# EAGLE design car1 (EAGLE 7.7.0)
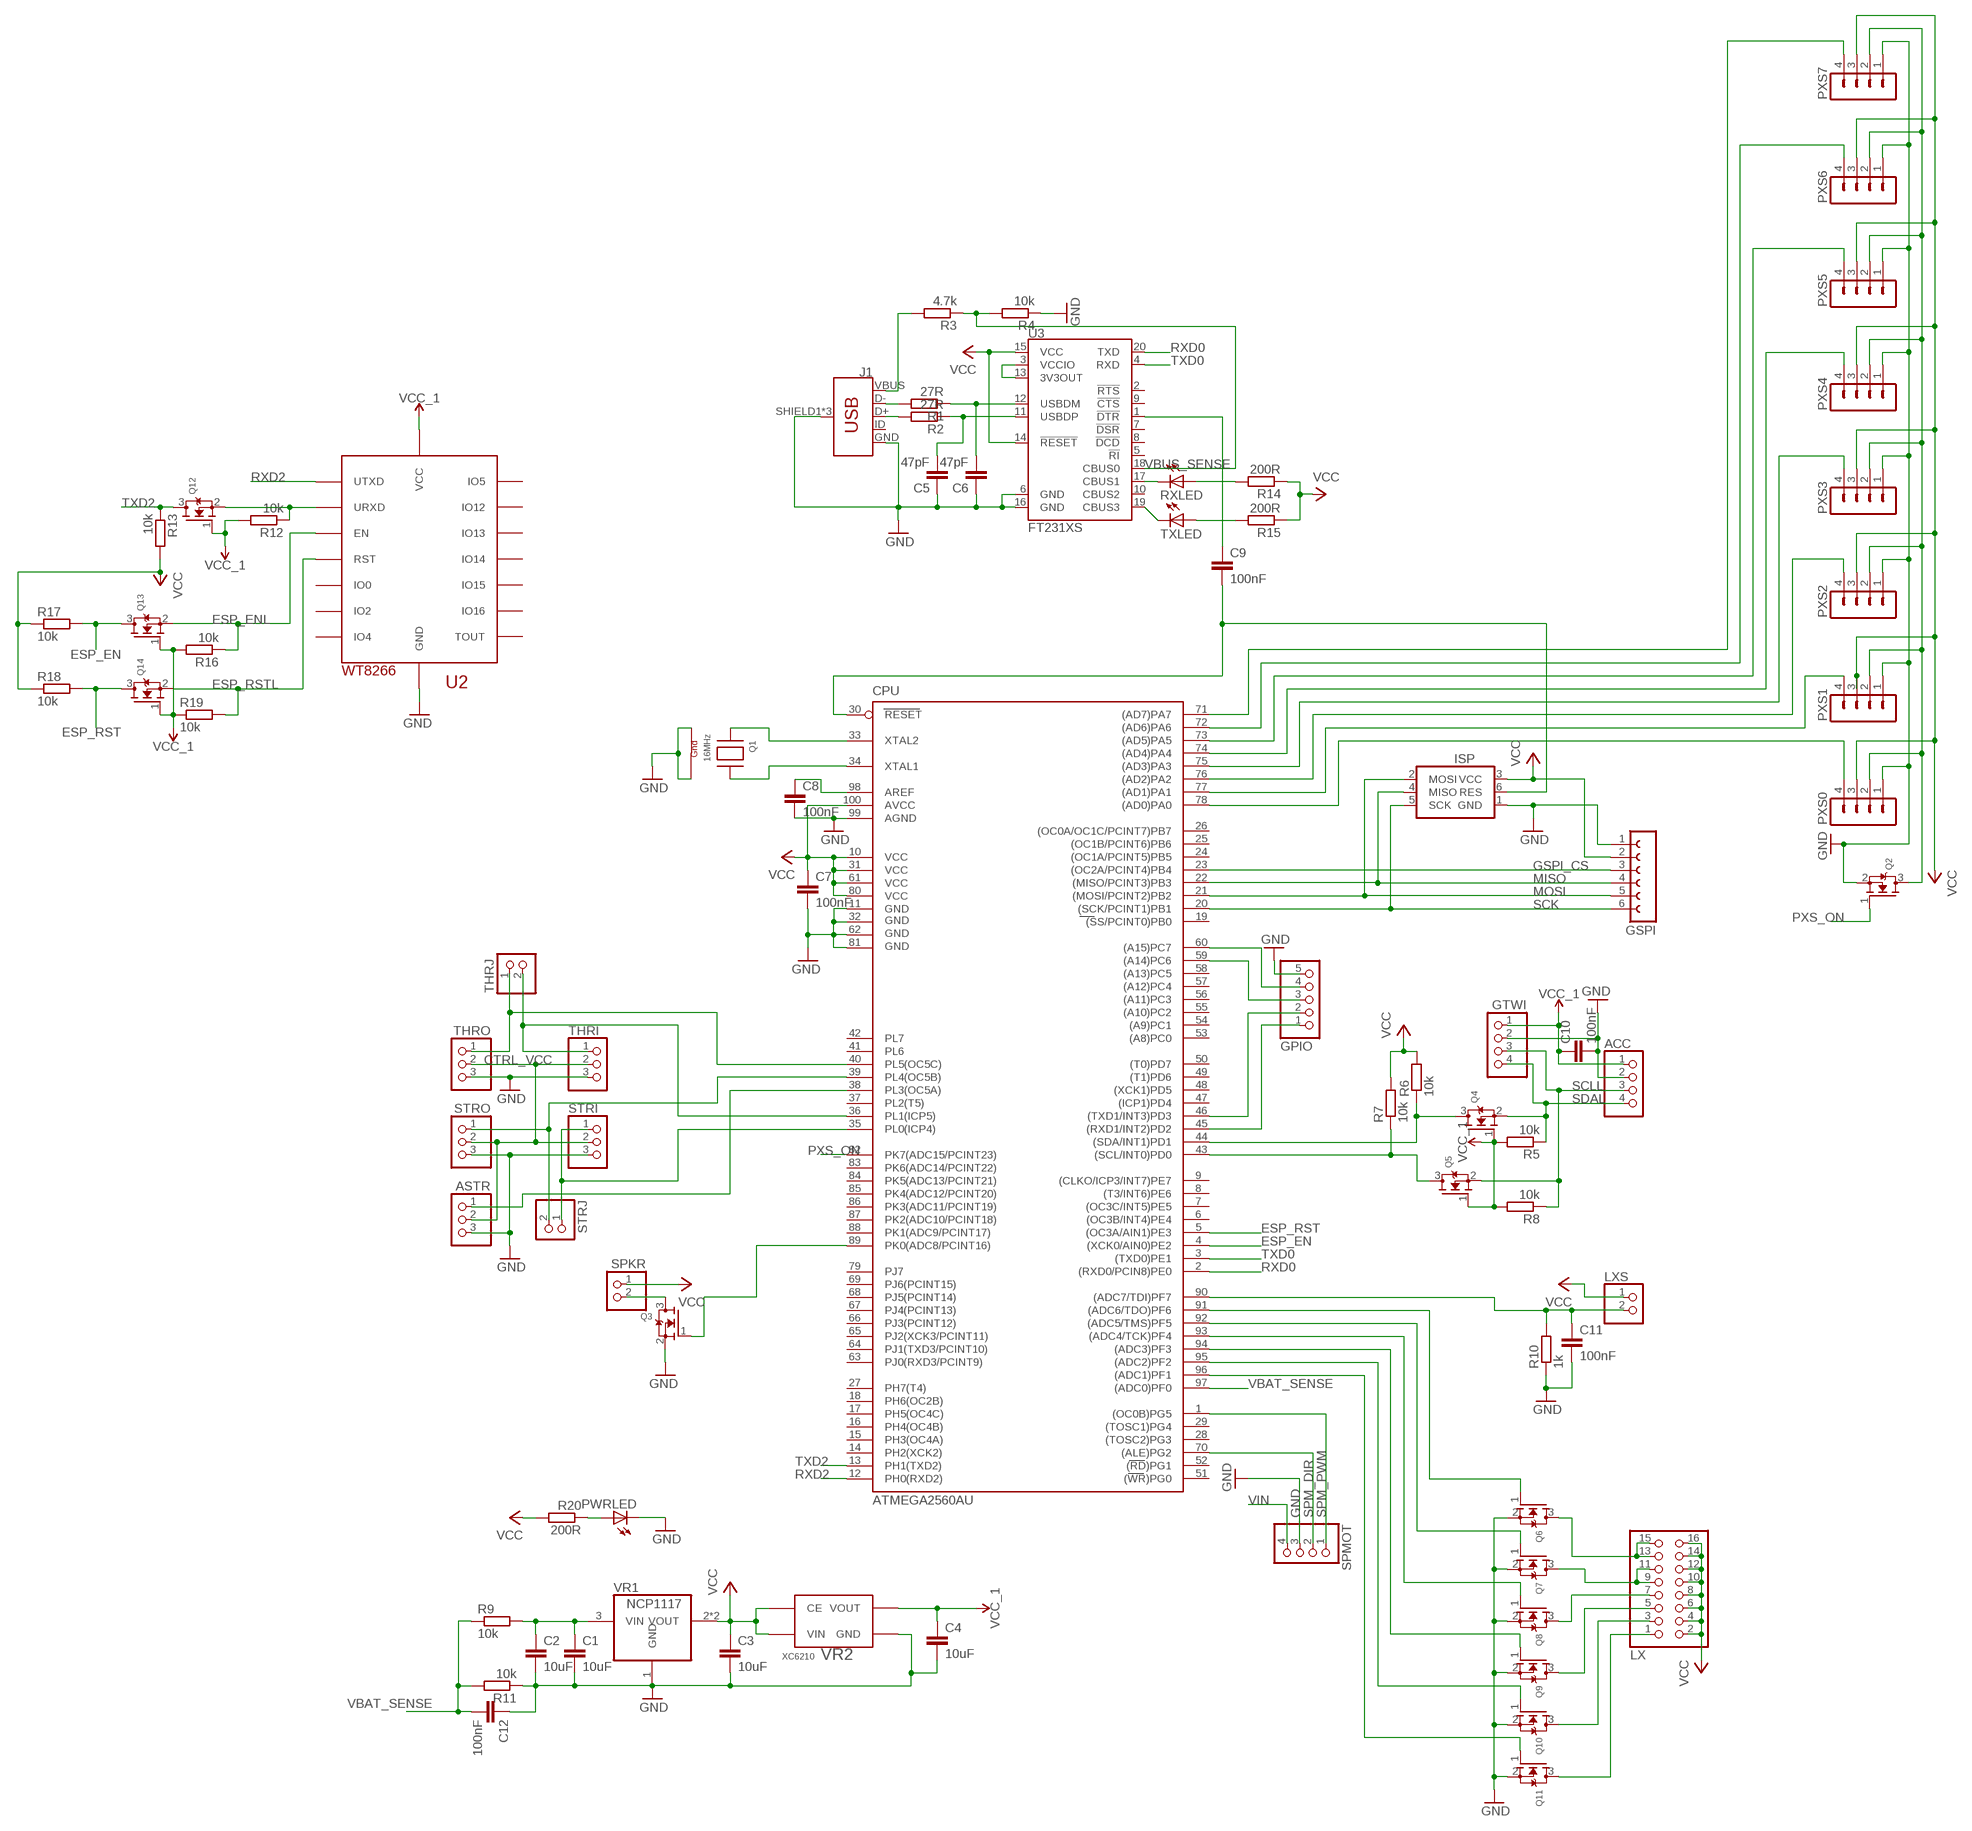
[diagram p0: schematic, sheet 1]

## Parts
ACC  PINHD-1X4  [1X04]
ASTR  PINHD-1X3  [1X03]
C1  10uF  C-EUC1206  [C1206]
C2  10uF  C-EUC1206  [C1206]
C3  10uF  C-EUC1206  [C1206]
C4  10uF  C-EUC1206  [C1206]
C5  47pF  C-EUC0603  [C0603]
C6  47pF  C-EUC0603  [C0603]
C7  100nF  C-EUC1206  [C1206]
C8  100nF  C-EUC1206  [C1206]
C9  100nF  C-EUC1206  [C1206]
C10  100nF  C-EUC1206  [C1206]
C11  100nF  C-EUC1206  [C1206]
C12  100nF  C-EUC1206  [C1206]
CPU  ATMEGA2560AU  [TQFP100]
GPIO  PINHD-1X5  [1X05]
GSPI  FE06W  [FE06W]
GTWI  PINHD-1X4/90  [1X04/90]
ISP  ISP  [ISP]
J1  USB_MICRO-B_FEMALE-SMT  [USB-B-MICRO-SMD]
LX  PINHD-2X8  [2X08]
LXS  PINHD-1X2  [1X02]
PWRLED  LEDCHIP-LED0603  [CHIP-LED0603]
PXS0  MA04-1  [MA04-1]
PXS1  MA04-1  [MA04-1]
PXS2  MA04-1  [MA04-1]
PXS3  MA04-1  [MA04-1]
PXS4  MA04-1  [MA04-1]
PXS5  MA04-1  [MA04-1]
PXS6  MA04-1  [MA04-1]
PXS7  MA04-1  [MA04-1]
Q1  16MHz  XTAL-4-3225  [NX3225]
Q2  MOSFET-NREFLOW  [SOT23]
Q3  MOSFET-NREFLOW  [SOT23]
Q4  MOSFET-NREFLOW  [SOT23]
Q5  MOSFET-NREFLOW  [SOT23]
Q6  MOSFET-NREFLOW  [SOT23]
Q7  MOSFET-NREFLOW  [SOT23]
Q8  MOSFET-NREFLOW  [SOT23]
Q9  MOSFET-NREFLOW  [SOT23]
Q10  MOSFET-NREFLOW  [SOT23]
Q11  MOSFET-NREFLOW  [SOT23]
Q12  MOSFET-NREFLOW  [SOT23]
Q13  MOSFET-NREFLOW  [SOT23]
Q14  MOSFET-NREFLOW  [SOT23]
R1  27R  R-EU_R0603  [R0603]
R2  27R  R-EU_R0603  [R0603]
R3  4.7k  R-EU_R0603  [R0603]
R4  10k  R-EU_R0603  [R0603]
R5  10k  R-EU_R0603  [R0603]
R6  10k  R-EU_R0603  [R0603]
R7  10k  R-EU_R0603  [R0603]
R8  10k  R-EU_R0603  [R0603]
R9  10k  R-EU_R0805  [R0805]
R10  1k  R-EU_R0603  [R0603]
R11  10k  R-EU_R0805  [R0805]
R12  10k  R-EU_R0603  [R0603]
R13  10k  R-EU_R0603  [R0603]
R14  200R  R-EU_R0603  [R0603]
R15  200R  R-EU_R0603  [R0603]
R16  10k  R-EU_R0603  [R0603]
R17  10k  R-EU_R0603  [R0603]
R18  10k  R-EU_R0603  [R0603]
R19  10k  R-EU_R0603  [R0603]
R20  200R  R-EU_R0603  [R0603]
RXLED  LEDCHIP-LED0603  [CHIP-LED0603]
SPKR  PINHD-1X2  [1X02]
SPMOT  PINHD-1X4/90  [1X04/90]
STRI  PINHD-1X3  [1X03]
STRJ  PINHD-1X2  [1X02]
STRO  PINHD-1X3  [1X03]
THRI  PINHD-1X3  [1X03]
THRJ  PINHD-1X2  [1X02]
THRO  PINHD-1X3  [1X03]
TXLED  LEDCHIP-LED0603  [CHIP-LED0603]
U2  WT8266  [WT8266]
U3  FT231XS  [SSOP20_L]
VR1  NCP1117  REG1117  [SOT223]
VR2  XC6210  [SOT25]

## Nets
!RST: C9.2 CPU.30(RESET) ISP.6(RES)
AREF: C8.1 CPU.98(AREF)
ASTR: ASTR.1 CPU.38(PL3(OC5A))
CTRL_VCC: ASTR.2 STRI.2 STRO.2 THRI.2 THRO.2
DTR: C9.1 U3.1(!DTR)
ESP_EN: CPU.4((XCK0/AIN0)PE2) Q13.3(D) R17.2
ESP_ENL: Q13.2(S) R16.1 U2.EN
ESP_RST: CPU.5((OC3A/AIN1)PE3) Q14.3(D) R18.2
ESP_RSTL: Q14.2(S) R19.2 U2.RST
GND: ACC.2 ASTR.3 C1.2 C2.2 C3.2 C4.2 C5.1 C6.1 C7.2 C8.2 C10.2 C11.2 C12.1 CPU.11(GND) CPU.32(GND1) CPU.62(GND2) CPU.81(GND3) CPU.99(AGND) GPIO.5 GSPI.1 GTWI.2 ISP.1(GND) J1.GND J1.SHIELD1(SHIELD) J1.SHIELD2(SHIELD) J1.SHIELD3(SHIELD) PWRLED.C PXS0.1 PXS1.1 PXS2.1 PXS3.1 PXS4.1 PXS5.1 PXS6.1 PXS7.1 Q1.2(G2) Q1.4(G1) Q2.2(S) Q3.2(S) Q6.2(S) Q7.2(S) Q8.2(S) Q9.2(S) Q10.2(S) Q11.2(S) R4.1 R10.1 R11.1 SPMOT.3 STRI.3 STRO.3 THRI.3 THRO.3 U2.GND0(GND) U2.GND1(GND) U2.GND2(GND) U3.6(GND) U3.16(GND) VR1.1(GND) VR2.2(GND)
GSPI_CS: CPU.23((OC2A/PCINT4)PB4) GSPI.3
LX0: CPU.96((ADC1)PF1) Q11.1(G)
LX1: CPU.95((ADC2)PF2) Q10.1(G)
LX2: CPU.94((ADC3)PF3) Q9.1(G)
LX3: CPU.93((ADC4/TCK)PF4) Q8.1(G)
LX4: CPU.92((ADC5/TMS)PF5) Q7.1(G)
LX5: CPU.91((ADC6/TDO)PF6) Q6.1(G)
LXS: C11.1 CPU.90((ADC7/TDI)PF7) LXS.2 R10.2
MISO: CPU.22((MISO/PCINT3)PB3) GSPI.4 ISP.4(MISO)
MOSI: CPU.21((MOSI/PCINT2)PB2) GSPI.5 ISP.2(MOSI)
N$1: CPU.33(XTAL2) Q1.1(X1)
N$2: CPU.34(XTAL1) Q1.3(X2)
N$3: CPU.60((A15)PC7) GPIO.4
N$4: CPU.59((A14)PC6) GPIO.3
N$5: CPU.46((TXD1/INT3)PD3) GPIO.2
N$6: CPU.45((RXD1/INT2)PD2) GPIO.1
N$7: PWRLED.A R20.1
N$10: R15.2 TXLED.A
N$11: R14.2 RXLED.A
N$13: CPU.78((AD0)PA0) PXS0.4
N$14: CPU.77((AD1)PA1) PXS1.4
N$15: LX.13 LX.15 Q6.3(D)
N$16: LX.9 LX.11 Q7.3(D)
N$17: CPU.76((AD2)PA2) PXS2.4
N$18: LX.7 Q8.3(D)
N$19: LX.5 Q9.3(D)
N$20: LX.3 Q10.3(D)
N$21: LX.1 Q11.3(D)
N$22: CPU.75((AD3)PA3) PXS3.4
N$24: CPU.74((AD4)PA4) PXS4.4
N$25: CPU.73((AD5)PA5) PXS5.4
N$26: CPU.72((AD6)PA6) PXS6.4
N$27: CPU.71((AD7)PA7) PXS7.4
PXS_ON: CPU.82(PK7(ADC15/PCINT23)) Q2.1(G)
PXSO: PXS0.2 PXS1.2 PXS2.2 PXS3.2 PXS4.2 PXS5.2 PXS6.2 PXS7.2 Q2.3(D)
RXD0: CPU.2((RXD0/PCIN8)PE0) U3.20(TXD)
RXD2: CPU.12(PH0(RXD2)) U2.UTXD
RXLED: RXLED.C U3.17(CBUS1)
SCK: CPU.20((SCK/PCINT1)PB1) GSPI.6 ISP.5(SCK)
SCL: CPU.43((SCL/INT0)PD0) Q5.3(D) R7.1
SCLL: ACC.3 GTWI.3 Q5.2(S) R8.1
SDA: CPU.44((SDA/INT1)PD1) Q4.3(D) R6.1
SDAL: ACC.4 GTWI.4 Q4.2(S) R5.1
SPKR: CPU.89(PK0(ADC8/PCINT16)) Q3.1(G)
SPKR0: Q3.3(D) SPKR.2
SPM_DIR: CPU.70((ALE)PG2) SPMOT.2
SPM_PWM: CPU.1((OC0B)PG5) SPMOT.1
STRI: CPU.35(PL0(ICP4)) STRI.1 STRJ.1
STRO: CPU.39(PL4(OC5B)) STRJ.2 STRO.1
THRI: CPU.36(PL1(ICP5)) THRI.1 THRJ.2
THRO: CPU.40(PL5(OC5C)) THRJ.1 THRO.1
TXD0: CPU.3((TXD0)PE1) U3.4(RXD)
TXD2: CPU.13(PH1(TXD2)) Q12.3(D) R13.1
TXLED: TXLED.C U3.19(CBUS3)
URXD: Q12.2(S) R12.1 U2.URXD
USBD+: J1.D+ R2.2
USBD-: J1.D- R1.2
USBDM: C6.2 R1.1 U3.12(USBDM)
USBDP: C5.2 R2.1 U3.11(USBDP)
VBAT_SENSE: C12.2 CPU.97((ADC0)PF0) R9.1 R11.2
VBUS: J1.VBUS R3.2
VBUS_SENSE: R3.1 R4.2 U3.18(CBUS0)
VCC: C3.1 C7.1 CPU.10(VCC) CPU.31(VCC1) CPU.61(VCC2) CPU.80(VCC3) CPU.100(AVCC) GSPI.2 ISP.3(VCC) LX.2 LX.4 LX.6 LX.8 LX.10 LX.12 LX.14 LX.16 LXS.1 PXS0.3 PXS1.3 PXS2.3 PXS3.3 PXS4.3 PXS5.3 PXS6.3 PXS7.3 R6.2 R7.2 R13.2 R14.1 R15.1 R17.1 R18.1 R20.2 SPKR.1 U3.14(!RESET) U3.15(VCC) VR1.2(VOUT) VR1.4(VOUT) VR2.1(VIN) VR2.3(CE)
VCC_1: ACC.1 C4.1 C10.1 GTWI.1 Q4.1(G) Q5.1(G) Q12.1(G) Q13.1(G) Q14.1(G) R5.2 R8.2 R12.2 R16.2 R19.1 U2.3V3(VCC) VR2.5(VOUT)
VCCIO: U3.3(VCCIO) U3.13(3V3OUT)
VIN: C1.1 C2.1 R9.2 SPMOT.4 VR1.3(VIN)
Unconnected: CPU.6((OC3B/INT4)PE4) CPU.7((OC3C/INT5)PE5) CPU.8((T3/INT6)PE6) CPU.9((CLKO/ICP3/INT7)PE7) CPU.14(PH2(XCK2)) CPU.15(PH3(OC4A)) CPU.16(PH4(OC4B)) CPU.17(PH5(OC4C)) CPU.18(PH6(OC2B)) CPU.19((SS/PCINT0)PB0) CPU.24((OC1A/PCINT5)PB5) CPU.25((OC1B/PCINT6)PB6) CPU.26((OC0A/OC1C/PCINT7)PB7) CPU.27(PH7(T4)) CPU.28((TOSC2)PG3) CPU.29((TOSC1)PG4) CPU.37(PL2(T5)) CPU.41(PL6) CPU.42(PL7) CPU.47((ICP1)PD4) CPU.48((XCK1)PD5) CPU.49((T1)PD6) CPU.50((T0)PD7) CPU.51((WR)PG0) CPU.52((RD)PG1) CPU.53((A8)PC0) CPU.54((A9)PC1) CPU.55((A10)PC2) CPU.56((A11)PC3) CPU.57((A12)PC4) CPU.58((A13)PC5) CPU.63(PJ0(RXD3/PCINT9)) CPU.64(PJ1(TXD3/PCINT10)) CPU.65(PJ2(XCK3/PCINT11)) CPU.66(PJ3(PCINT12)) CPU.67(PJ4(PCINT13)) CPU.68(PJ5(PCINT14)) CPU.69(PJ6(PCINT15)) CPU.79(PJ7) CPU.83(PK6(ADC14/PCINT22)) CPU.84(PK5(ADC13/PCINT21)) CPU.85(PK4(ADC12/PCINT20)) CPU.86(PK3(ADC11/PCINT19)) CPU.87(PK2(ADC10/PCINT18)) CPU.88(PK1(ADC9/PCINT17)) J1.ID U2.IO0 U2.IO2 U2.IO4 U2.IO5 U2.IO12 U2.IO13 U2.IO14 U2.IO15 U2.IO16 U2.TOUT U3.2(!RTS) U3.5(!RI) U3.7(!DSR) U3.8(!DCD) U3.9(!CTS) U3.10(CBUS2)

## Library data of the parts
ACC GTWI SPMOT = pinhead:PINHD-1X4: PIN HEADER
ASTR STRI STRO THRI THRO = adafruit:PINHD-1X3: PIN HEADER
C1-C12 = rcl:C-EU: CAPACITOR, European symbol
CPU = SparkFun-IC-Microcontroller:ATMEGA2560: Atmel 100-pin 8-bit uC 64/128/256 Kbytes FLASH 4 Kbytes EEPROM 8 Kbytes SRAM 86 General Purpose I/O pins 12-channels16-bit PWM 4 x Serial USARTs 16-channels 10-bit A/D SparkFun Products None.; PROD_ID: IC-10040
GPIO = pinhead:PINHD-1X5: PIN HEADER
GSPI = con-lsta:FE06W: FEMALE HEADER; OC_FARNELL: unknown; OC_NEWARK: unknown
ISP = custom:ISP
J1 = SparkFun-Connectors:USB_MICRO-B: USB Type Micro-B Connector Male/female and PTH/SMT variants SparkFun Products: SparkFun microB USB Breakout <https://www.sparkfun.com/products/12035> SparkFun USB microB Plug Breakout <https://www.sparkfun.com/products/10031> SparkFun ESP8266 Thing <https://www.sparkfun.com/products/13231>; PROD_ID: CONN-11752
LX = pinhead:PINHD-2X8: PIN HEADER
LXS SPKR STRJ THRJ = pinhead:PINHD-1X2: PIN HEADER
PWRLED RXLED TXLED = adafruit:LED: LED OSRAM: - CHIPLED LG R971, LG N971, LY N971, LG Q971, LY Q971, LO R971, LY R971 LH N974, LH R974 LS Q976, LO Q976, LY Q976 LO Q996 - Hyper CHIPLED LW Q18S LB Q993, LB Q99A, LB R99A - SideLED LS A670, LO A670, LY A670, LG A670, LP A670 LB A673, LV A673, LT A673, LW A673 LH A674 LY A675 LS A676, LA A676, LO A676, LY A676, LW A676 LS A679, LY A679, LG A679 - Hyper Micro SIDELED® LS Y876, LA Y876, LO Y876, LY Y876 LT Y87S - SmartLED LW L88C, LW L88S LB L89C, LB L89S, LG L890 LS L89K, LO L89K, LY L89K LS L896, LA L896, LO L896, LY L896 - TOPLED LS T670, LO T670, LY T670, LG T670, LP T670 LSG T670, LSP T670, LSY T670, LOP T670, LYG T670 LG T671, LOG T671, LSG T671 LB T673, LV T673, LT T673, LW T673 LH T674 LS T676, LA T676, LO T676, LY T676, LB T676, LH T676, LSB T676, LW T676 LB T67C, LV T67C, LT T67C, LS T67K, LO T67K, LY T67K, LW E67C LS E67B, LA E67B, LO E67B, LY E67B, LB E67C, LV E67C, LT E67C LW T67C LS T679, LY T679, LG T679 LS T770, LO T770, LY T770, LG T770, LP T770 LB T773, LV T773, LT T773, LW T773 LH T774 LS E675, LA E675, LY E675, LS T675 LS T776, LA T776, LO T776, LY T776, LB T776 LHGB T686 LT T68C, LB T68C - Hyper Mini TOPLED® LB M676 - Mini TOPLED Santana® LG M470 LS M47K, LO M47K, LY M47K Source: http://www.osram.convergy.de/
PXS0 PXS1-PXS7 = custom:MA04-1: PIN HEADER; OC_FARNELL: unknown; OC_NEWARK: unknown
Q1 = adafruit:XTAL-4: Classic 4-pin 3.2 x 2.5mm crystal
Q2-Q14 = adafruit:MOSFET-N: N-Channel Mosfet 2N7002E - 60V 260mA SOT23 [Digikey: 2N7002ET1GOSTR-ND] - REEL BSH103 - 30V 850mA SOT23 [Digikey: 568-5013-1-ND]
R1-R20 = custom:R-EU_: RESISTOR, European symbol
U2 = custom:WT8266
U3 = SparkFun-IC-Comms:FT231X: FTDI FT231X Full Speed USB to Full-handshake UART This USB2.0 Full Speed IC offers a compact bridge to full handshake UART interfaces. The device is a UART, capable of operating up to 3MBaud, with low power consumption (8mA). The FT231X includes the complete FT-X series feature set and enables USB to be added into a system design quickly and easily over a UART interface. Datasheet <http://cdn.sparkfun.com/datasheets/Components/General%20IC/DS_FT231X.pdf> SparkFun Products SparkFun RedBoard - Programmed with Arduino <https://www.sparkfun.com/products/12757> (DEV-12757) SparkFun XBee Explorer USB <https://www.sparkfun.com/products/11812> (WRL-11812) SparkFun XBee Explorer Dongle <https://www.sparkfun.com/products/11697> (WRL-11697) SparkFun Blynk Board - ESP8266 <https://www.sparkfun.com/products/13794> (WRL-13794) SparkFun ESP8266 Thing - Dev Board <https://www.sparkfun.com/products/13711> (WRL-13711) SparkFun Block for Intel® Edison - Base <https://www.sparkfun.com/products/13045> (DEV-13045) SparkFun RedStick <https://www.sparkfun.com/products/13741> (DEV-13741) SparkFun Beefy 3 - FTDI Basic Breakout <https://www.sparkfun.com/products/13746> (DEV-13746) SparkFun FT231X Breakout <https://www.sparkfun.com/products/11736> (BOB-11736); PROD_ID: IC-11524
VR1 = burr-brown:REG1117: 800mA and 1A Low Dropout (LDO) Positive Regulator 1.8V, 2.5V, 2.85V, 3.3V, 5V, and Adj; MPN: REG1117; OC_FARNELL: 1097566; OC_NEWARK: 14P6981
VR2 = custom:XC6210

## Board
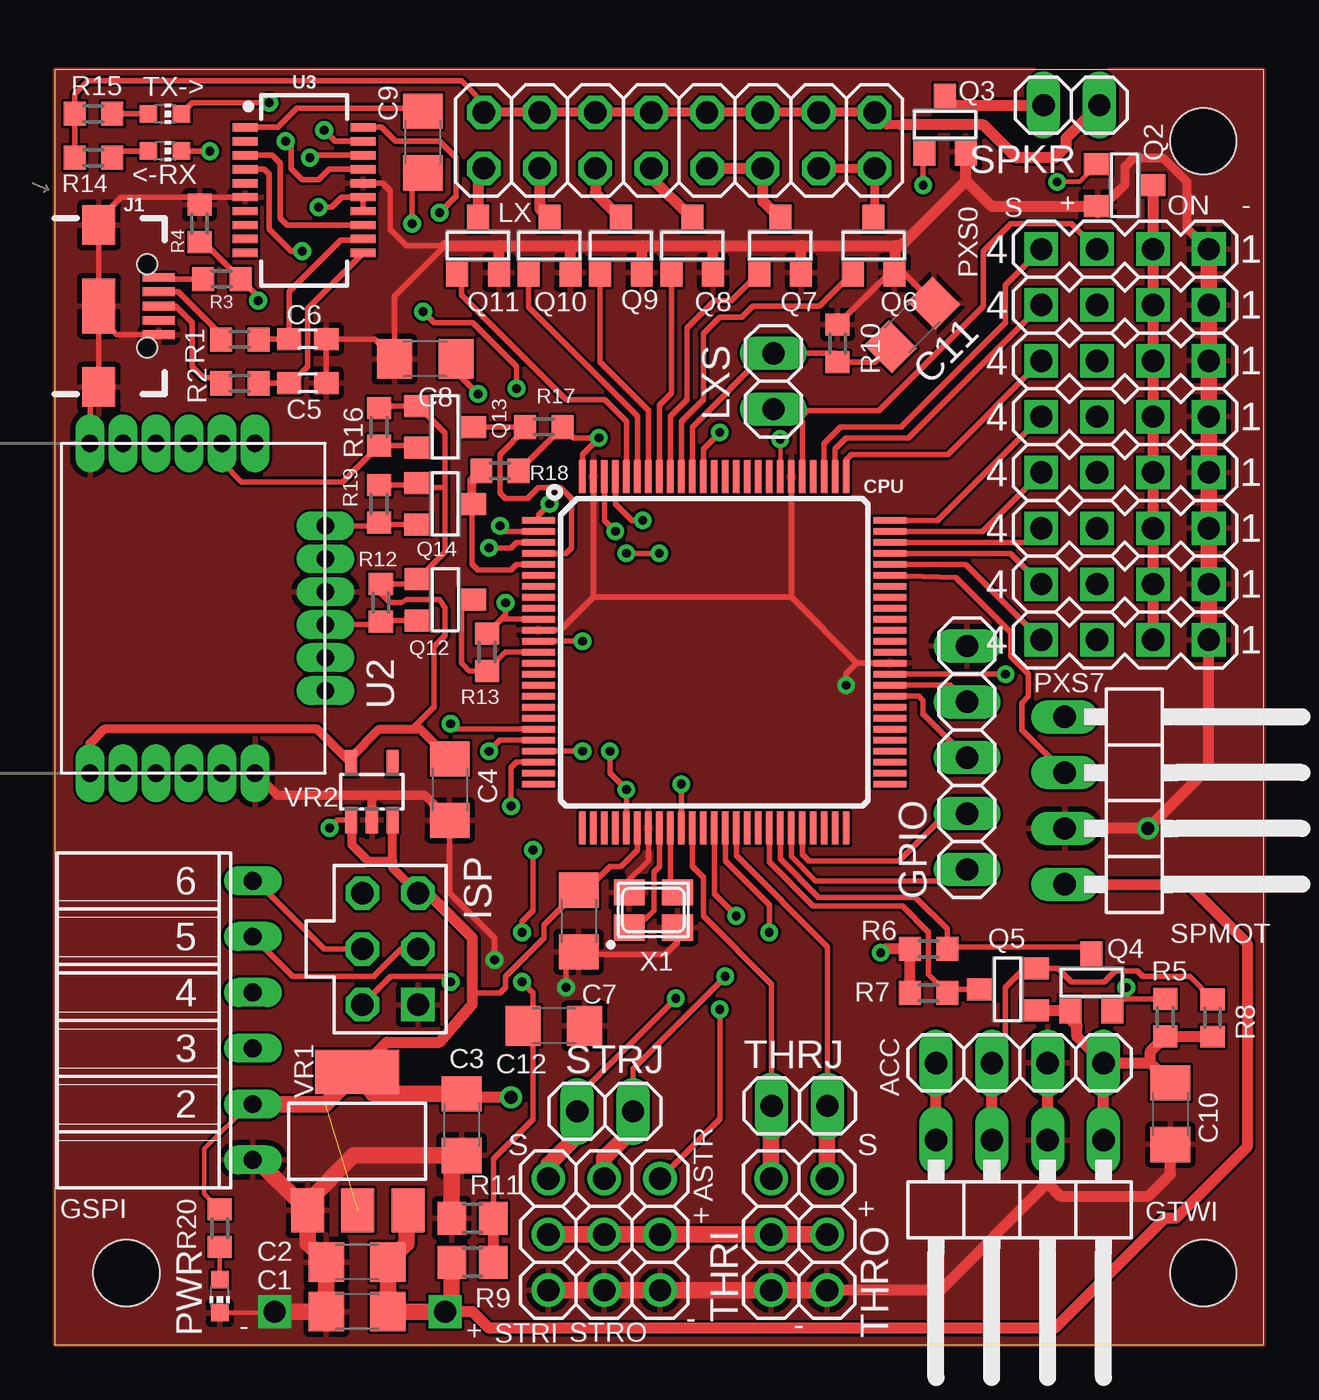
[diagram p1: board, top side]
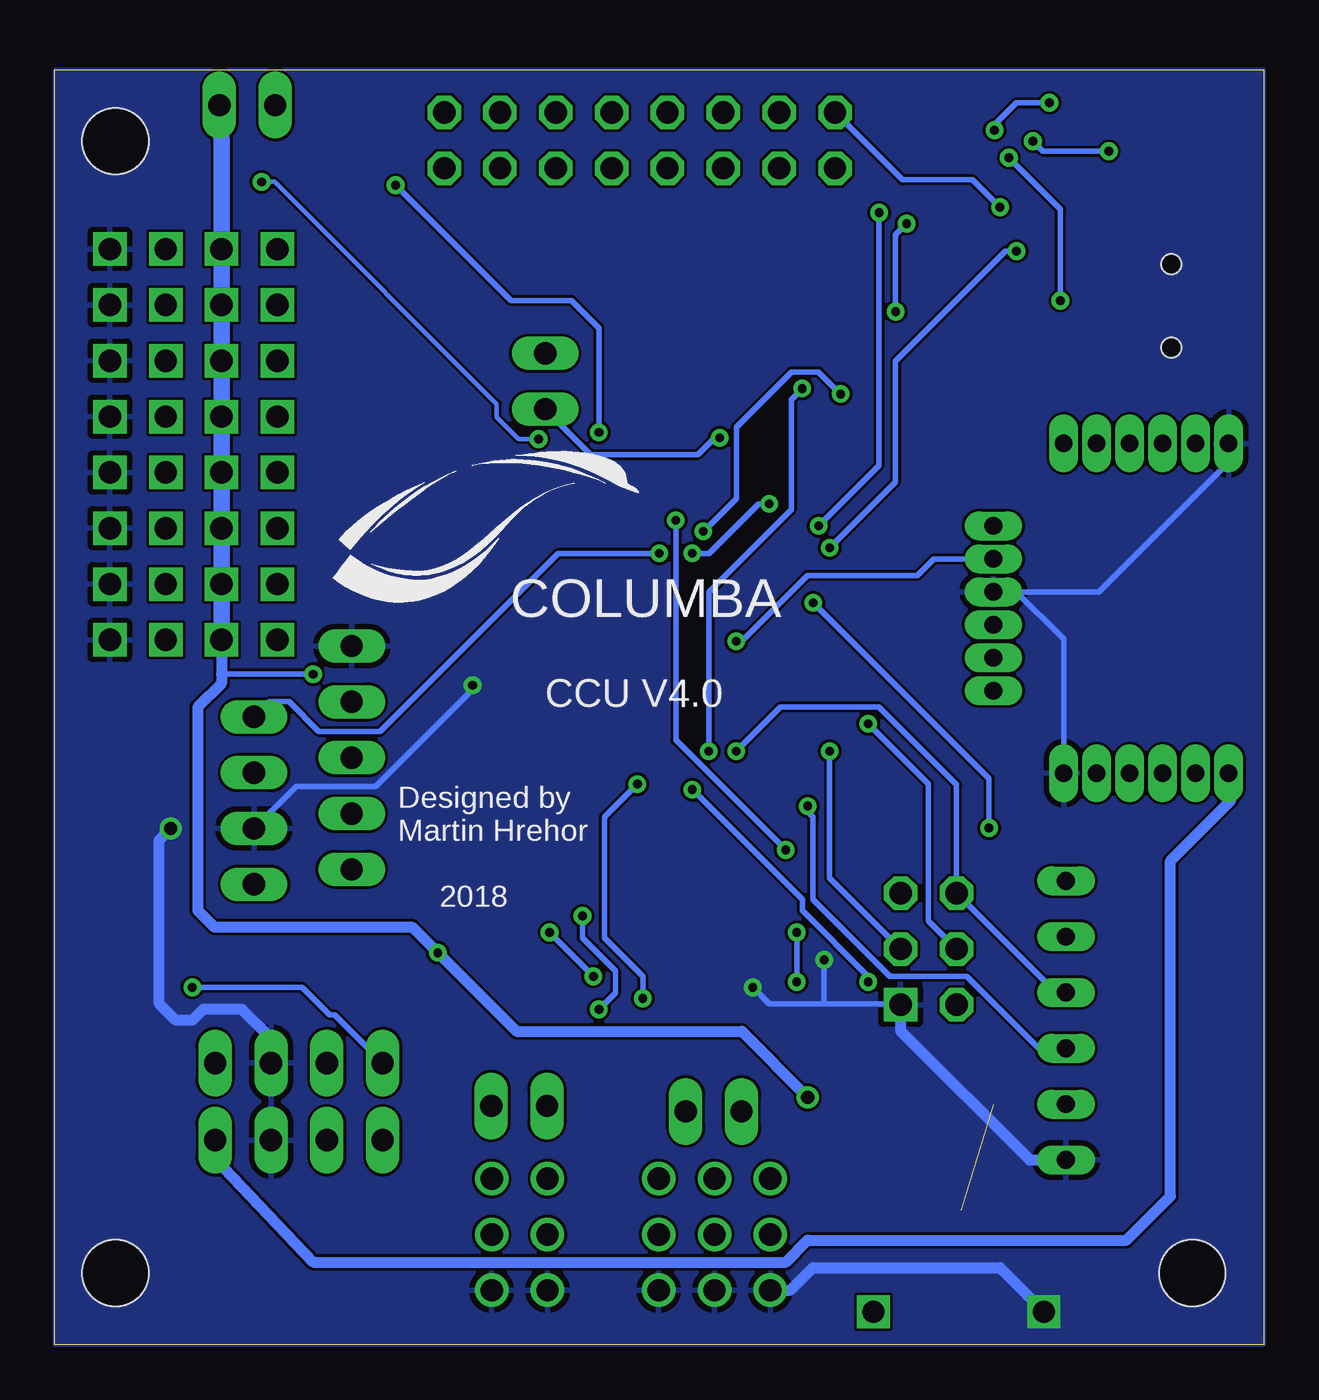
[diagram p2: board, bottom side, seen from below]

Size 55 x 58 mm. Coordinates in mm from the lower left corner, seen from the top.
Outline: 0,0 55,0 55,58 0,58 0,0
Copper layers (1*16): Top 0.035mm / dielectric 1.5mm / Bottom 0.035mm
Design rules "jlcpcb": minimum track width 5mil, minimum drill 0.3mm, track to track 5mil, track to pad 5mil, pad to pad 5mil, via to via 5mil, smd to smd 5mil, copper to edge 0mil, drill to drill 5mil, minimum pad ring 10mil, minimum via ring 8mil, stop-mask expansion 4mil, vias tented up to drill 0mil, thermal gap 10mil
Holes 3 mm at 3.25,3.25 52.25,3.25 52.25,54.75

### Footprints (pad centres in the part's own frame; a part is rotated, then mirrored left to right if it is on the bottom)
1X04 = drill 1.016 long: 1 -3.81,0; 2 -1.27,0; 3 1.27,0; 4 3.81,0
1X03 = drill 1.016: 1 -2.54,0; 2 0,0; 3 2.54,0
C1206 = smd 1.6 x 1.8: 1 -1.4,0; 2 1.4,0
C0603 = smd 1.1 x 1: 1 -0.85,0; 2 0.85,0
TQFP100 = smd 1.5 x 0.3: 1 -8,6; 2 -8,5.5; 3 -8,5; 4 -8,4.5; 5 -8,4; 6 -8,3.5; 7 -8,3; 8 -8,2.5; 9 -8,2; 10 -8,1.5; 11 -8,1; 12 -8,0.5; 13 -8,0; 14 -8,-0.5; 15 -8,-1; 16 -8,-1.5; 17 -8,-2; 18 -8,-2.5; 19 -8,-3; 20 -8,-3.5; 21 -8,-4; 22 -8,-4.5; 23 -8,-5; 24 -8,-5.5; 25 -8,-6; 51 8,-6; 52 8,-5.5; 53 8,-5; 54 8,-4.5; 55 8,-4; 56 8,-3.5; 57 8,-3; 58 8,-2.5; 59 8,-2; 60 8,-1.5; 61 8,-1; 62 8,-0.5; 63 8,0; 64 8,0.5; 65 8,1; 66 8,1.5; 67 8,2; 68 8,2.5; 69 8,3; 70 8,3.5; 71 8,4; 72 8,4.5; 73 8,5; 74 8,5.5; 75 8,6 | smd 0.3 x 1.5: 26 -6,-8; 27 -5.5,-8; 28 -5,-8; 29 -4.5,-8; 30 -4,-8; 31 -3.5,-8; 32 -3,-8; 33 -2.5,-8; 34 -2,-8; 35 -1.5,-8; 36 -1,-8; 37 -0.5,-8; 38 0,-8; 39 0.5,-8; 40 1,-8; 41 1.5,-8; 42 2,-8; 43 2.5,-8; 44 3,-8; 45 3.5,-8; 46 4,-8; 47 4.5,-8; 48 5,-8; 49 5.5,-8; 50 6,-8; 76 6,8; 77 5.5,8; 78 5,8; 79 4.5,8; 80 4,8; 81 3.5,8; 82 3,8; 83 2.5,8; 84 2,8; 85 1.5,8; 86 1,8; 87 0.5,8; 88 0,8; 89 -0.5,8; 90 -1,8; 91 -1.5,8; 92 -2,8; 93 -2.5,8; 94 -3,8; 95 -3.5,8; 96 -4,8; 97 -4.5,8; 98 -5,8; 99 -5.5,8; 100 -6,8
1X05 = drill 1.016 long: 1 -5.08,0; 2 -2.54,0; 3 0,0; 4 2.54,0; 5 5.08,0
FE06W = drill 0.813 long: 1 -6.35,0; 2 -3.81,0; 3 -1.27,0; 4 1.27,0; 5 3.81,0; 6 6.35,0
1X04/90 = drill 1.016 long: 1 -3.81,-3.81; 2 -1.27,-3.81; 3 1.27,-3.81; 4 3.81,-3.81
ISP = drill 1.016 square: 1 -2.54,-1.27 | drill 1.016 octagon: 2 0,-1.27; 3 2.54,-1.27; 4 2.54,1.27; 5 0,1.27; 6 -2.54,1.27
USB-B-MICRO-SMD = smd 1.45 x 0.4: D+ 2.725,0; D- 2.725,0.65; GND 2.725,-1.3; ID 2.725,-0.65; VBUS 2.725,1.3 | smd 1.5 x 1.8: SHIELD1 0,3.685; SHIELD2 0,-3.685 | smd 1.5 x 2.5: SHIELD3 0,0 | hole 0.9: 2.2,1.9; 2.2,-1.9
2X08 = drill 1.016 octagon: 1 -8.89,-1.27; 2 -8.89,1.27; 3 -6.35,-1.27; 4 -6.35,1.27; 5 -3.81,-1.27; 6 -3.81,1.27; 7 -1.27,-1.27; 8 -1.27,1.27; 9 1.27,-1.27; 10 1.27,1.27; 11 3.81,-1.27; 12 3.81,1.27; 13 6.35,-1.27; 14 6.35,1.27; 15 8.89,-1.27; 16 8.89,1.27
1X02 = drill 1.016 long: 1 -1.27,0; 2 1.27,0
CHIP-LED0603 = smd 0.8 x 0.8: A 0,-0.75; C 0,0.75
MA04-1 = drill 1.016 square: 1 -3.81,0; 2 -1.27,0; 3 1.27,0; 4 3.81,0
NX3225 = smd 1.4 x 1.2: 1 -1.1,-0.8; 2 1.1,-0.8; 3 1.1,0.8; 4 -1.1,0.8
SOT23 = smd 1 x 1.27: 1 -0.95,-1.227; 2 0.95,-1.227; 3 0,1.227
R0603 = smd 1 x 1.1: 1 -0.85,0; 2 0.85,0
R0805 = smd 1.3 x 1.5: 1 -0.95,0; 2 0.95,0
WT8266 = drill 0.8 pad 0.9 long: 3V3 -7.5,1.4; EN 7.5,-4.6; GND0 -7.5,-6.1; GND1 0.75,-9.3; GND2 7.5,1.4; IO0 -7.5,-1.6; IO2 -7.5,-3.1; IO4 -7.5,-0.1; IO5 -2.25,-9.3; IO12 7.5,-1.6; IO13 -3.75,-9.3; IO14 7.5,-0.1; IO15 -7.5,-4.6; IO16 7.5,-3.1; RST 3.75,-9.3; TOUT 7.5,-6.1; URXD -0.75,-9.3; UTXD 2.25,-9.3
SSOP20_L = smd 0.381 x 1.143: 1 -2.857,-2.68; 2 -2.223,-2.68; 3 -1.587,-2.68; 4 -0.953,-2.68; 5 -0.318,-2.68; 6 0.318,-2.68; 7 0.953,-2.68; 8 1.587,-2.68; 9 2.223,-2.68; 10 2.857,-2.68; 11 2.857,2.68; 12 2.223,2.68; 13 1.587,2.68; 14 0.953,2.68; 15 0.318,2.68; 16 -0.318,2.68; 17 -0.953,2.68; 18 -1.587,2.68; 19 -2.223,2.68; 20 -2.857,2.68
SOT223 = smd 1.499 x 2.007: 1 -2.261,-3.15; 2 0.025,-3.15; 3 2.311,-3.15 | smd 3.81 x 2.007: 4 0,3.15
SOT25 = smd 0.55 x 1.2: 1 -0.95,-1.3; 2 0,-1.3; 3 0.95,-1.3; 4 0.95,1.3; 5 -0.95,1.3

### Placement (x,y rotation side)
ACC  43.9,12.81 180 top
ASTR  27.53,5.01 270 top
C1  13.75,1.5 180 top
C2  13.75,3.75 180 top
C3  18.5,10 270 top
C4  17.96,25.25 270 top
C5  11.5,43.75 180 top
C6  11.5,45.75 180 top
C7  23.83,19.27 270 top
C8  16.85,44.84 180 top
C9  16.73,54.71 270 top
C10  50.75,10.5 270 top
C11  39,46.4 45 top
C12  22.7,14.5 180 top
CPU  30,31.5 0 top
GPIO  41.5,26.7 90 top
GSPI  9,14.75 90 top
GTWI  43.9,5.49 180 top
ISP  15.25,18 90 top
J1  2,47.25 0 top
LX  28.4,54.79 0 top
LXS  32.69,43.83 90 top
PWRLED  7.5,2.2 180 top
PXS0  48.69,49.84 180 top
PXS1  48.69,47.3 180 top
PXS2  48.69,44.76 180 top
PXS3  48.69,42.22 180 top
PXS4  48.69,39.68 180 top
PXS5  48.69,37.14 180 top
PXS6  48.69,34.6 180 top
PXS7  48.69,32.06 180 top
Q1  27.23,19.77 0 top
Q2  48.67,52.75 270 top
Q3  40.5,55.5 0 top
Q4  47.16,16.47 0 top
Q5  43.35,16.16 90 top
Q6  37.25,50 0 top
Q7  33,50 0 top
Q8  29,50 0 top
Q9  25.75,50 0 top
Q10  22.5,50 0 top
Q11  19.25,50 0 top
Q12  17.76,33.89 270 top
Q13  17.75,41.75 270 top
Q14  17.75,38.25 270 top
R1  8.41,45.73 180 top
R2  8.41,43.73 180 top
R3  7.59,48.48 180 top
R4  6.58,51.01 270 top
R5  50.52,14.88 270 top
R6  39.75,18 180 top
R7  39.75,16 180 top
R8  52.67,14.86 270 top
R9  19,3.75 180 top
R10  35.61,45.55 270 top
R11  19,5.75 0 top
R12  14.83,33.75 90 top
R13  19.66,31.5 90 top
R14  1.75,54 0 top
R15  1.75,56 0 top
R16  14.75,41.75 90 top
R17  22.25,41.75 180 top
R18  20.25,39.75 180 top
R19  14.75,38.25 270 top
R20  7.5,5.3 90 top
RXLED  5,54.3 270 top
SPKR  46.25,56.39 180 top
SPMOT  49.75,24.75 270 top
STRI  22.45,5.01 270 top
STRJ  25.03,10.61 0 top
STRO  24.99,5.01 270 top
THRI  32.59,5.01 270 top
THRJ  33.88,10.86 180 top
THRO  35.13,5.01 270 top
TXLED  5,56 270 top
U2  3,33.5 90 top
U3  11.34,52.52 270 top
VR1  13.75,9.25 0 top
VR2  14.42,25.16 0 top

### Tracks (layer width: path | path; a pad name or v marks a point on that pad's centre or on a via)
!RST  (via drill 0.4 pad 0.6)
  Top 0.25: ISP.6 15.27,16.75 17.75,16.75 v18,16.5 | CPU.30 v26,25.25 25.25,26 v25.25,27 | C9.2 16.25,52.83 v16.25,51 | v16.75,47 17.25,46.5 19,46.5 21,44.5 v21,43.5
  Bottom 0.25: v18,16.5 18,16.75 21,19.75 21,20.25 v26,25.25 | v16.25,51 16.75,50.5 v16.75,47 | v21,43.5 21.5,43 21.5,38 25.25,34.25 v25.25,27
AREF  (via drill 0.4 pad 0.6)
  Top 0.25: CPU.98 25,37.5 v25.5,37 | v19.25,43.25 18.25,44.25 C8.1
  Bottom 0.25: v25.5,37 24,38.5 24,41.75 21.5,44.25 20.25,44.25 v19.25,43.25
ASTR  (via drill 0.4 pad 0.6)
  Top 0.25: ASTR.1 30.25,10.27 v30.25,15.25 | v31,19.5 30,20.5 CPU.38
  Bottom 0.25: v31,19.5 31,18.5 29.5,17 29.5,16 v30.25,15.25
CTRL_VCC
  Top 0.75: STRI.2 STRO.2 ASTR.2 THRI.2 THRO.2
DTR
  Top 0.25: C9.1 16.59,56.25 11,56.25 10.13,55.38 U3.1
ESP_EN
  Top 0.25: Q13.3 R17.2 21.4,41.65 20.25,40.5 20.25,38.75 20.5,38.5 21.5,38.5 22,39 23,39 23.5,38.5 23.5,36.25 23.25,36 CPU.4
ESP_ENL
  Top 0.25: Q13.2 16.42,40.9 R16.1 13.1,39.25 8.5,39.25 7.6,40.15 U2.EN
ESP_RST
  Top 0.25: Q14.3 18.98,35.52 19.25,35.25 20.75,35.25 21,35.5 CPU.5
  Top 0.4: Q14.3 18.98,39.33 R18.2
ESP_RSTL
  Top 0.25: U2.RST 14.6,37.25 R19.2 14.85,37.3 Q14.2
GND  (via drill 0.4 pad 0.6, 0.6 pad 0.8, 1)
  Top 0.2: PWRLED.C 10,1.45 v10,1.5
  Top 0.25: J1.GND 2.8,45.95 2.25,46.5 2.25,47.25 J1.SHIELD3 | U3.16 14.91,52.84 15.25,52.5 15.25,50.75 16,50 17.75,50 15.45,47.7 C8.2 14.54,45.75 C6.1 C5.1 | U3.6 6.75,52.2 | 6.75,52.2 3.02,52.2 2,51.19 J1.SHIELD1 J1.SHIELD3 | J1.SHIELD3 J1.SHIELD2 1.6,43.16 U2.GND2 | R4.1 6.75,52.03 6.75,52.2 | CPU.32 27,22 26.13,21.13 Q1.4 25.82,20.57 | 24.25,18.5 24.25,18.29 C7.2 | Q1.2 28.33,18.33 27.75,17.75 23.95,17.75 C7.2 | 36.5,31 CPU.62 | CPU.99 24.5,34 | 24.5,34 23,32.5 CPU.11 | CPU.81 33.5,34 | 33.5,34 24.5,34 | 33.5,34 36.5,31 | 38.2,48.69 38.2,48.7 | 38.2,48.7 Q6.2 | v23.25,16.25 23.25,17.29 C7.2 | C4.2 17.96,20.54 20,18.5 v20,17.5 | v36,30 36,30.5 36.5,31 | R10.1 38.01,48.8 38.2,48.8 | C11.2 38.68,48.7 38.2,48.7
  Top 0.4: VR2.2 14.42,24.92 14.5,25 | 14.5,25 16.81,25 C4.2 | U2.GND0 10.1,25 14.5,25 | 47.3,51.8 47.7,51.8 48.7,52.8 48.7,53.6 49.1,54 50.4,54 51.5,52.9 51.5,50.8 52.5,49.8
  Top 0.5: 41.47,54.25 Q3.2 41.45,52.95 | Q11.2 20.2,49.95 20.25,50 | 20.25,50 23.5,50 | 23.5,50 26.75,50 | 26.75,50 30,50 | 30,50 34,50 | 34,50 38.25,50 | 38.25,50 38.5,50 41.45,52.95 | Q6.2 38.25,48.82 38.25,50 | Q7.2 33.95,49.95 34,50 | Q8.2 29.95,49.95 30,50 | Q9.2 26.7,49.95 26.75,50 | Q10.2 23.45,49.95 23.5,50 | 17.75,50 20.25,50 | 41.45,52.95 42.6,51.8 47.3,51.8 Q2.2 | PXS7.1 52.5,26.25 v49.73,23.48 SPMOT.3 | ACC.2 GTWI.2 45.17,7.33 | 45.17,7.33 45.75,6.75 49.75,6.75 50.75,7.75 C10.2 | 45.15,7.35 40.3,2.5 35.1,2.5 THRO.3 | 45.15,7.35 45.2,7.4 | 45.17,7.33 45.15,7.35
  Top 0.75: v10,1.5 C1.2 C2.2 11.49,4.61 VR1.1 | VR1.1 9,8.59 GSPI.1 | R11.1 18.05,8.15 C3.2 13.6,8.6 11.5,6.5 11.5,5.86 VR1.1 | STRI.3 STRO.3 ASTR.3 THRI.3 THRO.3 | PXS7.1 PXS6.1 PXS5.1 PXS4.1 PXS3.1 PXS2.1 PXS1.1 52.5,49.8 PXS0.1
  Bottom 0.25: U2.GND0 9.1,32.1 11.25,34.25 U2.GND1 7.5,34.25 1.6,40.15 U2.GND2 | ISP.1 16.56,15.5 20,15.5 | 20,15.5 22.5,15.5 v23.25,16.25 | v20,17.5 20,15.5 | SPMOT.3 44.02,25.4 40.4,25.4 36,29.8 v36,30
  Bottom 0.5: ISP.1 16.52,14.27 10.65,8.4 GSPI.1 | ACC.2 45.17,13.92 46.5,15.25 48.25,15.25 48.75,14.75 49.5,14.75 50.25,15.5 50.25,22.96 v49.73,23.48 | STRI.3 21.53,2.47 20.5,3.5 12,3.5 v10,1.5
  pour Bottom: 0,0 0,58 55,58 55,0
  pour Top: 0,0 0,58 55,58 55,0
GSPI_CS  (via drill 0.4 pad 0.6)
  Top 0.25: v20.75,24.5 20.75,26.25 21,26.5 CPU.23
  Bottom 0.25: GSPI.3 10.23,13.48 13.5,16.75 17,16.75 20.5,20.25 20.5,24 20.75,24.25 v20.75,24.5
LX0
  Top 0.25: CPU.96 26,42 25,43 23.25,43 18.5,47.75 18.5,48.57 Q11.1
LX1
  Top 0.25: Q10.1 21.55,47.2 26.5,42.25 CPU.95
LX2
  Top 0.25: Q9.1 24.8,44.7 27,42.5 CPU.94
LX3
  Top 0.25: Q8.1 28.05,43.3 27.5,42.75 CPU.93
LX4
  Top 0.25: Q7.1 30.78,47.5 30,47.5 28.75,46.25 28.75,43 28,42.25 CPU.92
LX5
  Top 0.25: Q6.1 34.78,47.25 31.75,47.25 31.25,46.75 30.25,46.75 29.5,46 29.5,43 28.5,42 CPU.91
LXS
  Top 0.25: CPU.90 29,41.75 32.35,45.1 LXS.2 35.51,45.1 R10.2 37.3,44.7 C11.1
MISO  (via drill 0.4 pad 0.6)
  Top 0.25: v24,27 CPU.22
  Bottom 0.25: GSPI.4 9.46,16.02 ISP.4 13.98,25.48 17.5,29 22,29 v24,27
MOSI  (via drill 0.4 pad 0.6)
  Top 0.25: GSPI.5 10.81,16.75 14.5,16.75 15.75,18 ISP.2 | CPU.21 20.25,27.5 v19.75,27
  Bottom 0.25: v19.75,27 19.75,21.23 ISP.2
N$1
  Top 0.25: Q1.1 26.47,18.97 27.25,19.75 27.25,21.5 27.5,21.75 CPU.33
N$2
  Top 0.25: CPU.34 28,21 28.33,20.67 Q1.3
N$3
  Top 0.25: GPIO.4 40.74,30 CPU.60
N$4
  Top 0.25: GPIO.3 39.5,28.7 39.5,29.3 39.3,29.5 CPU.59
N$5
  Top 0.25: CPU.46 34,22.3 34.3,22 38.4,22 40.5,24.1 41.44,24.1 GPIO.2
N$6
  Top 0.25: CPU.45 33.5,22.2 34.6,21.1 41.88,21.1 GPIO.1
N$7
  Top 0.2: PWRLED.A R20.1
N$10
  Top 0.25: R15.2 TXLED.A
N$11
  Top 0.25: R14.2 2.9,54.3 RXLED.A
N$13
  Top 0.25: PXS0.4 43.25,48.21 43.25,46.5 38.5,41.75 35.75,41.75 35,41 CPU.78
N$14
  Top 0.25: PXS1.4 38.83,41.25 36,41.25 35.5,40.75 CPU.77
N$15
  Top 0.4: LX.13 LX.15 37.29,51.27
  Top 0.5: Q6.3 37.29,51.27
N$16
  Top 0.5: Q7.3 32.21,52.02 LX.11 LX.9
N$17
  Top 0.25: CPU.76 36,40.25 36.25,40.5 40.62,40.5 PXS2.4
N$18
  Top 0.25: 27.13,53.1 LX.7
  Top 0.5: Q8.3 27.13,53.1
N$19
  Top 0.5: Q9.3 24.59,52.39 LX.5
N$20
  Top 0.5: Q10.3 22.05,51.68 LX.3
N$21
  Top 0.5: LX.1 19.25,53.26 Q11.3
N$22
  Top 0.25: PXS3.4 40.16,37.5 CPU.75
N$24
  Top 0.25: PXS4.4 42.2,37 CPU.74
N$25
  Top 0.25: PXS5.4 44.24,36.5 CPU.73
N$26
  Top 0.25: PXS6.4 43.48,36 CPU.72
N$27
  Top 0.25: PXS7.4 41.44,35.5 CPU.71
PXS_ON  (via drill 0.4 pad 0.6)
  Top 0.2: CPU.82 v33,41.2 | v45.6,52.9 46.64,52.9 Q2.1
  Bottom 0.2: v45.6,52.9 45,52.9 34.9,42.8 34.9,42.2 33.9,41.2 v33,41.2
PXSO
  Top 0.5: Q2.3 49.96,52.69 PXS0.2 PXS1.2 PXS2.2 PXS3.2 PXS4.2 PXS5.2 PXS6.2 PXS7.2
RXD0  (via drill 0.4 pad 0.6)
  Top 0.25: U3.20 14.87,55.38 15.5,54.75 17.5,54.75 18.25,54 18.25,52.25 v17.5,51.5 | v20.25,37.25 20.5,37 CPU.2
  Bottom 0.25: v17.5,51.5 17.5,40 v20.25,37.25
RXD2  (via drill 0.4 pad 0.6)
  Top 0.25: v24,32 CPU.12
  Bottom 0.25: v24,32 23.75,32 20.75,35 15.75,35 15,35.75 U2.UTXD
RXLED  (via drill 0.4 pad 0.6)
  Top 0.25: v7.05,54.3 RXLED.C | U3.17 12.47,53.47 12,53 11.25,53 10.75,53.5 10.75,54.5 v10.5,54.75
  Bottom 0.25: v7.05,54.3 10.05,54.3 v10.5,54.75
SCK  (via drill 0.4 pad 0.6)
  Top 0.25: GSPI.6 9.15,21.1 12.25,18 ISP.5 | v18,28.25 18.25,28 CPU.20
  Bottom 0.25: ISP.5 15.25,19.27 15.25,25.5 v18,28.25
SCL
  Top 0.25: Q5.3 40.76,16.16 R7.1 39.75,16.85 39.75,18.75 38.55,19.95 34.5,19.95 32.5,21.95 CPU.43
SCLL
  Top 0.25: ACC.3 43.25,13.43 43.25,16.25 44.11,17.11 Q5.2 45.64,17.11 46.25,16.5 47.75,16.5 48.25,17 49.25,17 49.5,16.75 51.63,16.75 R8.1
  Top 0.5: GTWI.3 ACC.3
SDA
  Top 0.25: Q4.3 46.76,18.1 40.7,18.1 R6.1 40.6,18.9 39.15,20.35 34.75,20.35 33,22.1 CPU.44
SDAL  (via drill 0.4 pad 0.6)
  Top 0.25: v48.75,16.25 48.77,15.73 | 48.77,15.73 R5.1 | Q4.2 48.6,15.73 48.77,15.73
  Top 0.5: GTWI.4 ACC.4
  Bottom 0.25: ACC.4 42.28,15 42.5,15 43.75,16.25 v48.75,16.25
SPKR  (via drill 0.4 pad 0.6)
  Top 0.25: CPU.89 29.5,40.75 v30.25,41.5 | v39.5,52.75 39.5,54.22 Q3.1
  Bottom 0.25: v30.25,41.5 30.25,46.25 31.5,47.5 34.25,47.5 v39.5,52.75
SPKR0
  Top 0.5: Q3.3 40.84,56.39 SPKR.2
SPM_DIR
  Top 0.25: SPMOT.2 44,27.96 44,29.2 44.3,29.5 44.3,30.5 43.5,31.3 43.5,32.4 41,34.9 CPU.70
SPM_PWM  (via drill 0.4 pad 0.6)
  Top 0.25: CPU.1 22,37.75 v22.5,38.25 | v26,36 v27.5,36
  Bottom 0.25: v22.5,38.25 23,38.25 25.25,36 v26,36 | v27.5,36 32.1,36 40.2,27.9 43,27.9 44.35,29.25 45.25,29.25 SPMOT.1
STRI  (via drill 0.4 pad 0.6)
  Top 0.25: STRJ.1 23.76,11.26 v28.25,15.75 | v28.5,25.5 CPU.35
  Top 0.75: STRI.1 22.45,8.2 23.75,9.5 STRJ.1
  Bottom 0.25: v28.25,15.75 28.25,16.75 30,18.5 30,24 v28.5,25.5
STRO  (via drill 0.4 pad 0.6)
  Top 0.25: STRJ.2 26.3,12.55 v30.5,16.75 | v32.5,18.75 32.5,20 30.5,22 CPU.39
  Top 0.75: STRO.1 24.99,8.49 26,9.5 26,10.31 STRJ.2
  Bottom 0.25: v30.5,16.75 v32.5,18.75
THRI
  Top 0.25: THRJ.2 32.61,16.39 29.5,19.5 29.5,21.25 29,21.75 CPU.36
  Top 0.75: THRI.1 32.59,10.84 THRJ.2
THRO
  Top 0.25: THRJ.1 35.15,18.1 31,22.25 CPU.40
  Top 0.75: THRO.1 35.13,10.84 THRJ.1
TXD0  (via drill 0.4 pad 0.6)
  Top 0.25: U3.4 9.53,53.47 9.75,53.25 9.75,50.75 10.75,49.75 v11.25,49.75 | v19.75,36.25 20.75,36.25 21,36.5 CPU.3
  Bottom 0.25: v11.25,49.75 11.75,49.75 16.75,44.75 16.75,39.25 v19.75,36.25
TXD2
  Top 0.25: 19.1,33.78 Q12.3 18.5,33.4 18.5,31 18.85,30.65 R13.1 20.51,31.5 CPU.13
TXLED  (via drill 0.4 pad 0.6)
  Top 0.25: TXLED.C 6.25,56.5 v9.75,56.5 | v12.25,55.25 12.76,54.74 U3.19
  Bottom 0.25: 10,56.5 v9.75,56.5 11.25,56.5 12.25,55.5 v12.25,55.25
URXD
  Top 0.25: Q12.2 14.87,32.94 R12.1 14.68,32.75 U2.URXD
USBD+
  Top 0.25: J1.D+ 5.5,47.25 6.25,46.5 6.25,44.5 6.75,44 7.29,44 R2.2
USBD-
  Top 0.25: J1.D- 5.6,47.9 7.56,45.94 R1.2
USBDM
  Top 0.25: R1.1 9.28,45.75 C6.2 10.65,47.9 13,50.25 13.97,50.25 U3.12
USBDP
  Top 0.25: R2.1 9.28,43.75 C5.2 10.75,43.75 11.5,44.5 11.5,47.14 U3.11
VBAT_SENSE  (via drill 0.4 pad 0.6)
  Top 0.25: CPU.97 25.5,38.25 26.25,37.5 v26.75,37.5 | R11.2 19.95,8.45 21.75,10.25 21.75,14.5 | v21.75,22.5 21.75,19.75 21.25,19.25 v21.25,18.75 | v21.25,16.5 21.75,16 21.75,14.5 | C12.2 21.75,14.5
  Top 0.5: R9.1 R11.2
  Bottom 0.25: v26.75,37.5 26.75,27.5 v21.75,22.5 | v21.25,18.75 v21.25,16.5
VBUS
  Top 0.25: 6.67,48.8 R3.2 4.79,48.48 J1.VBUS
VBUS_SENSE  (via drill 0.4 pad 0.6)
  Top 0.25: R4.2 6.76,50.16 R3.1 9.25,47.67 v9.25,47.5 | v11.6,54 11.64,54.11 U3.18
  Bottom 0.25: v9.25,47.5 9.25,51.65 v11.6,54
VCC  (via drill 0.4 pad 0.6, 0.6 pad 0.8)  (1 unrouted)
  Top 0.2: R20.2 6.8,6.85 6.8,8.9 8.84,10.94 GSPI.2
  Top 0.25: CPU.31 26.5,22.5 25.75,21.75 25.25,21.75 24.17,20.67 C7.1 22.25,19.09 22.25,18.5 20.5,16.75 20.5,16.25 20.25,16 19,16 | CPU.80 34,42 33.88,42.12 | 33.88,42.12 33.44,42.56 LXS.1 | CPU.100 24,40.5 v24.75,41.25 23.6,41.25 R17.1 R18.1 | R14.1 R15.1 0.9,56.9 1.5,57.5 18.5,57.5 19.51,56.49 LX.2 | CPU.10 20.31,33 R13.2 20.5,33.19 v20.5,33.75 | v12.5,23.5 12.86,23.86 VR2.1 | 33.88,42.12 34.25,42.5 37.5,42.5 42.25,47.25 42.25,49.75 43.5,51 46.25,51 PXS0.3 | CPU.61 v43.25,30.5 | v12,51.75 12.6,51.75 13.05,52.2 U3.15 U3.14
  Top 0.4: ISP.3 15.37,21.69 15.37,22 | 15.37,22 VR2.3 | VR2.1 13.5,23.83 13.5,22.75 14.25,22 15.37,22 | 38.5,55.5 37.85,55.5 LX.16 LX.14 LX.12 LX.10 LX.8 LX.6 LX.4 LX.2
  Top 0.5: VR1.4 15.1,13.75 17.5,13.75 19,15.5 19,16 19,18.5 16.96,20.54 ISP.3 | SPKR.1 46,54.87 46,54.5 45.5,54 43.75,54 42.25,55.5 38.5,55.5 | v20.75,11.25 18.65,11.25 C3.1 | R7.2 39.05,16.2 38.9,16.35 R6.2 37.75,18 v37.58,17.82
  Top 0.75: GSPI.2 12.29,10.94 VR1.4 14.5,11.4 C3.1
  Bottom 0.25: LXS.1 30.63,40.5 25.75,40.5 25,41.25 v24.75,41.25 | v20.5,33.75 12.5,25.75 v12.5,23.5 | v43.25,30.5 47.42,30.5 | v12,51.75 13.25,53 16.45,53 LX.2
  Bottom 0.5: PXS7.3 47.42,30.5 47.42,30.08 48.5,29 48.5,19.75 47.75,19 38.75,19 v37.58,17.82 34,14.25 23.75,14.25 v20.75,11.25
  Bottom 0.75: SPKR.1 47.42,54.74 PXS0.3 PXS1.3 PXS2.3 PXS3.3 PXS4.3 PXS5.3 PXS6.3 PXS7.3
VCC_1
  Top 0.25: R19.1 16.42,39.1 Q14.1 16.8,39.2 17,39 17.75,39 | R16.2 14.85,42.7 Q13.1 17.75,41.47 17.75,39 | 17.75,39 17.75,36.06 Q12.1 16.29,34.6 R12.2 14.83,34.17 15.25,33.75 15.75,33.75 16,33.9 17.5,33.9 17.75,33.5 17.75,32.25 17.25,31.75 17.25,29 16.25,28
  Top 0.4: C4.1 16.61,28 16.25,28 14.75,28 13.47,26.72 VR2.5 11.93,28 2.25,28 1.6,27.35 U2.3V3
  Top 0.5: GTWI.1 ACC.1 | ACC.1 49.84,12.81 | 49.84,12.81 C10.1 | 49.84,12.81 49.84,13.35 R5.2 52.65,14.03 R8.2 | ACC.1 46.5,14.02 46.5,14.5 46.21,14.79 Q4.1 46.18,15.21 Q5.1
  Bottom 0.5: U2.3V3 1.5,25.9 1.5,24.75 4.25,22 4.25,6.75 6.25,4.75 20.75,4.75 21.75,3.75 43.25,3.75 47.75,8.5 47.75,9.26 GTWI.1
VCCIO
  Top 0.25: U3.3 9.89,54.11 10.25,53.75 10.25,51.25 10.57,50.93 U3.13
VIN  (via drill 1)
  Top 0.5: SPMOT.4 51.56,20.94 54.25,18.25 54.25,9 51,5.75 50.5,5.75 45.5,0.75 19.75,0.75 19,1.5 v17.75,1.5
  Top 0.75: R9.2 18.05,1.8 v17.75,1.5 C1.1 C2.1 16,4.6 16,5.75 16.06,6.06 VR1.3

### Text on the board
tNames: TX-> | <-RX | + | S | ON | - | X1 | S | S | + | + | - | PWR | - | + | -
bNames: COLUMBA | CCU V4.0 | Designed by / Martin Hrehor | 2018